# Altium schematic sheet 01_POWER_BKUP.SchDoc
size A3
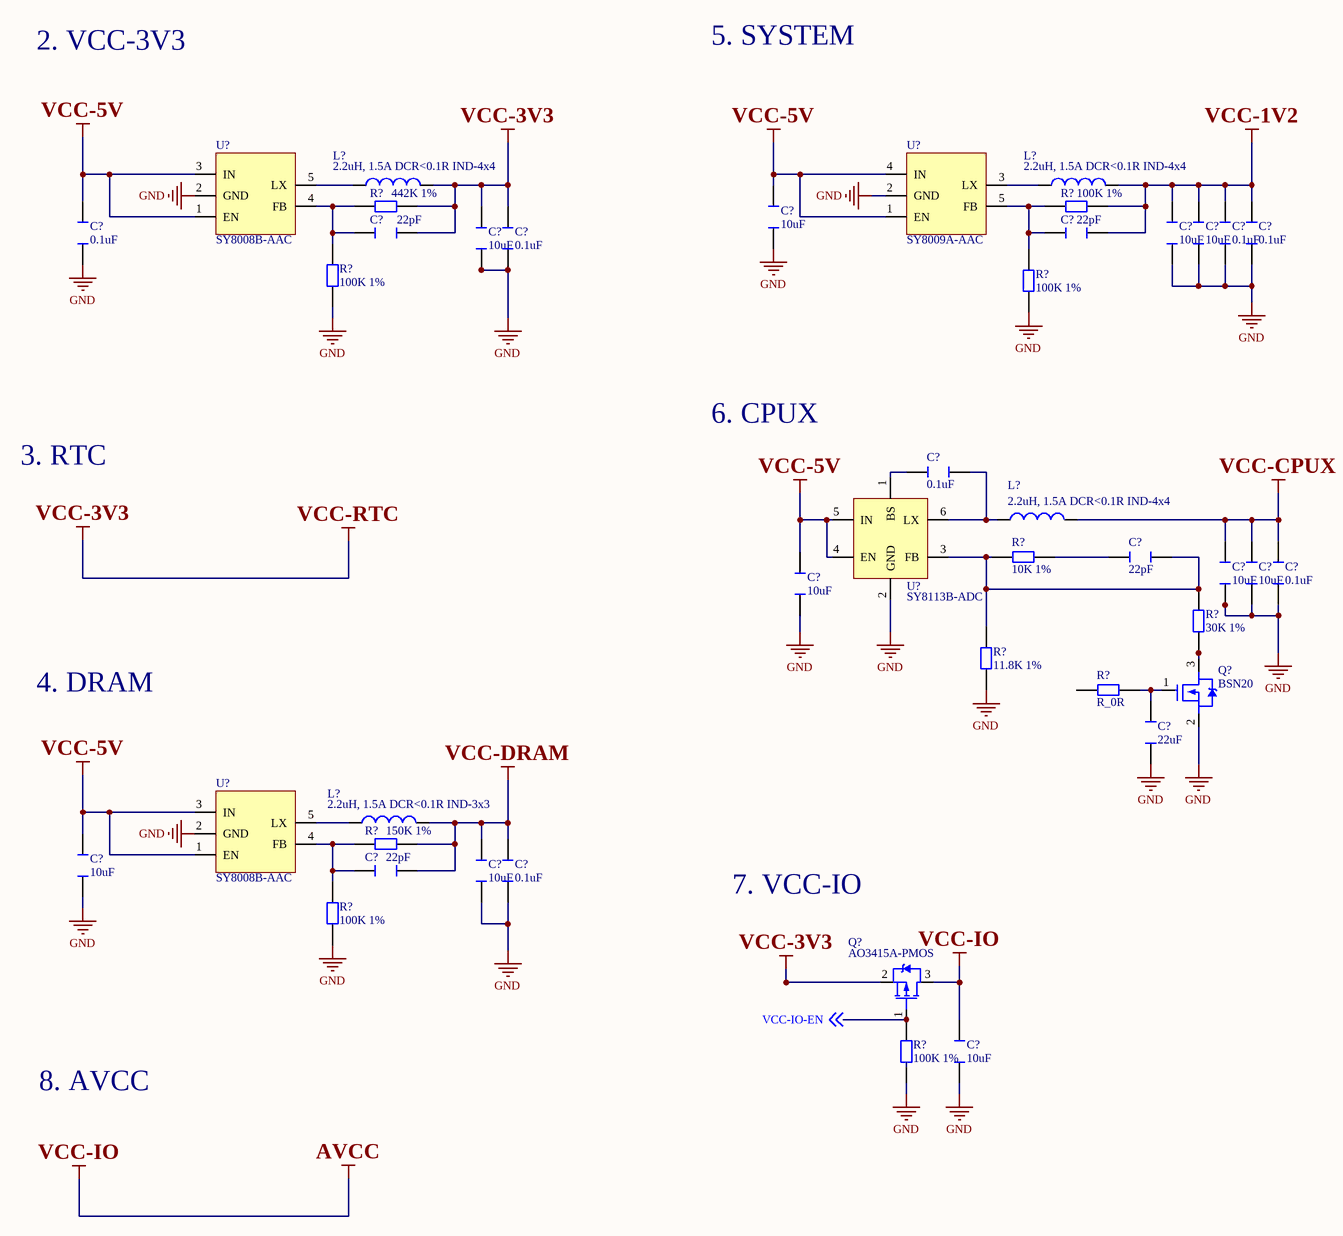
[diagram p0: 01_POWER_BKUP.SchDoc]

## Parts
(Parts that share a designator on the sheet are numbered #1, #2 ... from top to bottom, then left to right.)
C?#1  22pF  [C0603]
C?#2  10uF  [C0603]
C?#3  22pF  [C0603]
C?#4  0.1uF  [C0603]
C?#5  10uF  [C0603]
C?#6  10uF  [C0603]
C?#7  0.1uF  [C0603]
C?#8  0.1uF  [C0603]
C?#9  10uF  [C0603]
C?#10  0.1uF  [C0603]
C?#11  0.1uF  [C0603]
C?#12  22pF  [C0603]
C?#13  10uF  [C0603]
C?#14  10uF  [C0603]
C?#15  0.1uF  [C0603]
C?#16  10uF  [C0603]
C?#17  22uF  [C0603]
C?#18  22pF  [C0603]
C?#19  10uF  [C0603]
C?#20  10uF  [C0603]
C?#21  0.1uF  [C0603]
C?#22  10uF  [C0603]
L?#1  2.2uH, 1.5A DCR<0.1R IND-4x4  [SWPA4030S]
L?#2  2.2uH, 1.5A DCR<0.1R IND-4x4  [SWPA4030S]
L?#3  2.2uH, 1.5A DCR<0.1R IND-4x4  [SWPA4030S]
L?#4  2.2uH, 1.5A DCR<0.1R IND-3x3  [SWPA3015S]
Q?#1  BSN20  [SOT23_3]
Q?#2  AO3415A-PMOS  [SOT23_3]
R?#1  442K 1%  [R0603]
R?#2  100K 1%  [R0603]
R?#3  100K 1%  [R0603]
R?#4  100K 1%  [R0603]
R?#5  10K 1%  [R0603]
R?#6  30K 1%  [R0603]
R?#7  11.8K 1%  [R0603]
R?#8  R_0R  [R0603]
R?#9  150K 1%  [R0603]
R?#10  100K 1%  [R0603]
R?#11  100K 1%  [R0603]
U?#1  SY8008B-AAC  [SOT23_5]
U?#2  SY8009A-AAC  [SOT23_5]
U?#3  SY8113B-ADC  [SOT23_6]
U?#4  SY8008B-AAC  [SOT23_5]

## Nets
AVCC: C?#22.2 Q?#2.3(D)  [also labelled VCC-IO]
GND: C?#2.1 C?#4.1 C?#5.1 C?#6.1 C?#7.1 C?#8.1 C?#9.1 C?#10.1 C?#13.1 C?#14.1 C?#15.1 C?#16.1 C?#17.1 C?#19.1 C?#20.1 C?#21.1 C?#22.1 Q?#1.2 R?#3.1 R?#4.1 R?#7.1 R?#10.1 R?#11.1 U?#1.2(GND) U?#2.2(GND) U?#3.2(GND) U?#4.2(GND)
VCC-1V2: C?#3.2 C?#5.2 C?#6.2 C?#7.2 C?#8.2 L?#2.2 R?#2.2
VCC-3V3: C?#1.2 C?#9.2 C?#10.2 L?#1.2 Q?#2.2(S) R?#1.2  [also labelled VCC-RTC]
VCC-5V: C?#2.2 C?#4.2 C?#16.2 C?#19.2 U?#1.1(EN) U?#1.3(IN) U?#2.1(EN) U?#2.4(IN) U?#3.4(EN) U?#3.5(IN) U?#4.1(EN) U?#4.3(IN)
VCC-CPUX: C?#13.2 C?#14.2 C?#15.2 L?#3.2
VCC-DRAM: C?#18.2 C?#20.2 C?#21.2 L?#4.2 R?#9.2
VCC-IO-EN: Q?#2.1(G) R?#11.2 ; off-sheet VCC-IO-EN
NetC?#1_1: C?#1.1 R?#1.1 R?#3.2 U?#1.4(FB)
NetC?#3_1: C?#3.1 R?#2.1 R?#4.2 U?#2.5(FB)
NetC?#11_1: C?#11.1 U?#3.1(BS)
NetC?#11_2: C?#11.2 L?#3.1 U?#3.6(LX)
NetC?#12_1: C?#12.1 R?#5.1 R?#6.2 R?#7.2 U?#3.3(FB)
NetC?#12_2: C?#12.2 R?#5.2
NetC?#17_2: C?#17.2 Q?#1.1 R?#8.2
NetC?#18_1: C?#18.1 R?#9.1 R?#10.2 U?#4.4(FB)
NetL?#1_1: L?#1.1 U?#1.5(LX)
NetL?#2_1: L?#2.1 U?#2.3(LX)
NetL?#4_1: L?#4.1 U?#4.5(LX)
NetQ?#1_3: Q?#1.3 R?#6.1

Not connected (* = marked no-connect by the designer): R?#8 1(17)

## Notes on the sheet
- 2. VCC-3V3
- 5. SYSTEM
- 6. CPUX
- 3. RTC
- 4. DRAM
- 7. VCC-IO
- 8. AVCC

## Library data of the parts
C?#1 C?#3 C?#12 C?#18 = C_22PF
C?#2 C?#5 C?#6 C?#9 C?#13 C?#14 C?#16 C?#19 C?#20 C?#22 = C_10UF
C?#4 C?#7 C?#8 C?#10 C?#11 C?#15 C?#21 = C_0.1UF
C?#17 = C_22UF
L?#1-L?#3 = SWPA4030S2R2NT
L?#4 = SWPA3015S2R2NT
Q?#2 = AO3415A
R?#1 = R_442K_P1
R?#2-R?#4 R?#10 R?#11 = R_100K_P1
R?#5 = R_10K_P1
R?#6 = R_30K_P1
R?#7 = R_11K8_P1
R?#9 = R_150K_P1